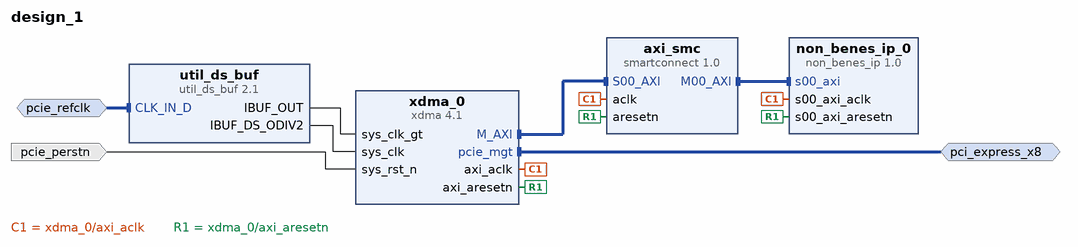
[diagram p0: block diagram of the top level]
# Vivado block design design_1, xcu280-fsvh2892-2L-e, Vivado 2020.2.2
create_bd_design design_1

create_bd_intf_port -mode Master -vlnv xilinx.com:interface:pcie_7x_mgt_rtl:1.0 pci_express_x8
create_bd_intf_port -mode Slave -vlnv xilinx.com:interface:diff_clock_rtl:1.0 pcie_refclk
set_property -dict {CONFIG.FREQ_HZ 100000000} [get_bd_intf_ports pcie_refclk]
create_bd_port -dir I -type rst pcie_perstn
set_property -dict {CONFIG.POLARITY ACTIVE_LOW} [get_bd_ports pcie_perstn]

create_bd_cell -type ip -vlnv user.org:user:non_benes_ip:1.0 non_benes_ip_0
create_bd_cell -type ip -vlnv xilinx.com:ip:xdma:4.1 xdma_0
set_property -dict [list \
  CONFIG.PCIE_BOARD_INTERFACE pci_express_x8 \
  CONFIG.SYS_RST_N_BOARD_INTERFACE pcie_perstn \
  CONFIG.axi_data_width 512_bit \
  CONFIG.axisten_freq 250 \
  CONFIG.pl_link_cap_max_link_speed 16.0_GT/s \
  CONFIG.xdma_axi_intf_mm AXI_Memory_Mapped \
  CONFIG.xdma_rnum_chnl 4 \
  CONFIG.xdma_wnum_chnl 4 \
] [get_bd_cells xdma_0]
create_bd_cell -type ip -vlnv xilinx.com:ip:util_ds_buf:2.1 util_ds_buf
set_property -dict {CONFIG.DIFF_CLK_IN_BOARD_INTERFACE pcie_refclk CONFIG.USE_BOARD_FLOW true} [get_bd_cells util_ds_buf]
create_bd_cell -type ip -vlnv xilinx.com:ip:smartconnect:1.0 axi_smc
set_property -dict {CONFIG.NUM_SI 1} [get_bd_cells axi_smc]

# ---- connections ----

connect_bd_intf_net [get_bd_intf_ports pci_express_x8] [get_bd_intf_pins xdma_0/pcie_mgt]
connect_bd_intf_net [get_bd_intf_ports pcie_refclk] [get_bd_intf_pins util_ds_buf/CLK_IN_D]
connect_bd_intf_net [get_bd_intf_pins xdma_0/M_AXI] [get_bd_intf_pins axi_smc/S00_AXI]
connect_bd_intf_net [get_bd_intf_pins axi_smc/M00_AXI] [get_bd_intf_pins non_benes_ip_0/s00_axi]
connect_bd_net [get_bd_ports pcie_perstn] [get_bd_pins xdma_0/sys_rst_n]
connect_bd_net [get_bd_pins util_ds_buf/IBUF_OUT] [get_bd_pins xdma_0/sys_clk_gt]
connect_bd_net [get_bd_pins util_ds_buf/IBUF_DS_ODIV2] [get_bd_pins xdma_0/sys_clk]
connect_bd_net [get_bd_pins xdma_0/axi_aclk] [get_bd_pins axi_smc/aclk] [get_bd_pins non_benes_ip_0/s00_axi_aclk]
connect_bd_net [get_bd_pins xdma_0/axi_aresetn] [get_bd_pins non_benes_ip_0/s00_axi_aresetn] [get_bd_pins axi_smc/aresetn]

# ---- address map ----
assign_bd_address -offset 0x0000000044A00000 -range 64K -target_address_space [get_bd_addr_spaces xdma_0/M_AXI] [get_bd_addr_segs non_benes_ip_0/s00_axi/reg0]

validate_bd_design
save_bd_design
